# EasyEDA schematic SCH_chris-dual-hd-connector-v3_2021-12-07.json
TITLE: Portenta 4 HD Student Shield; REV: 1.6; Date: 2021-09-13; Sheet: 1/1; Drawn By: rocksetta; Company: Rocksetta
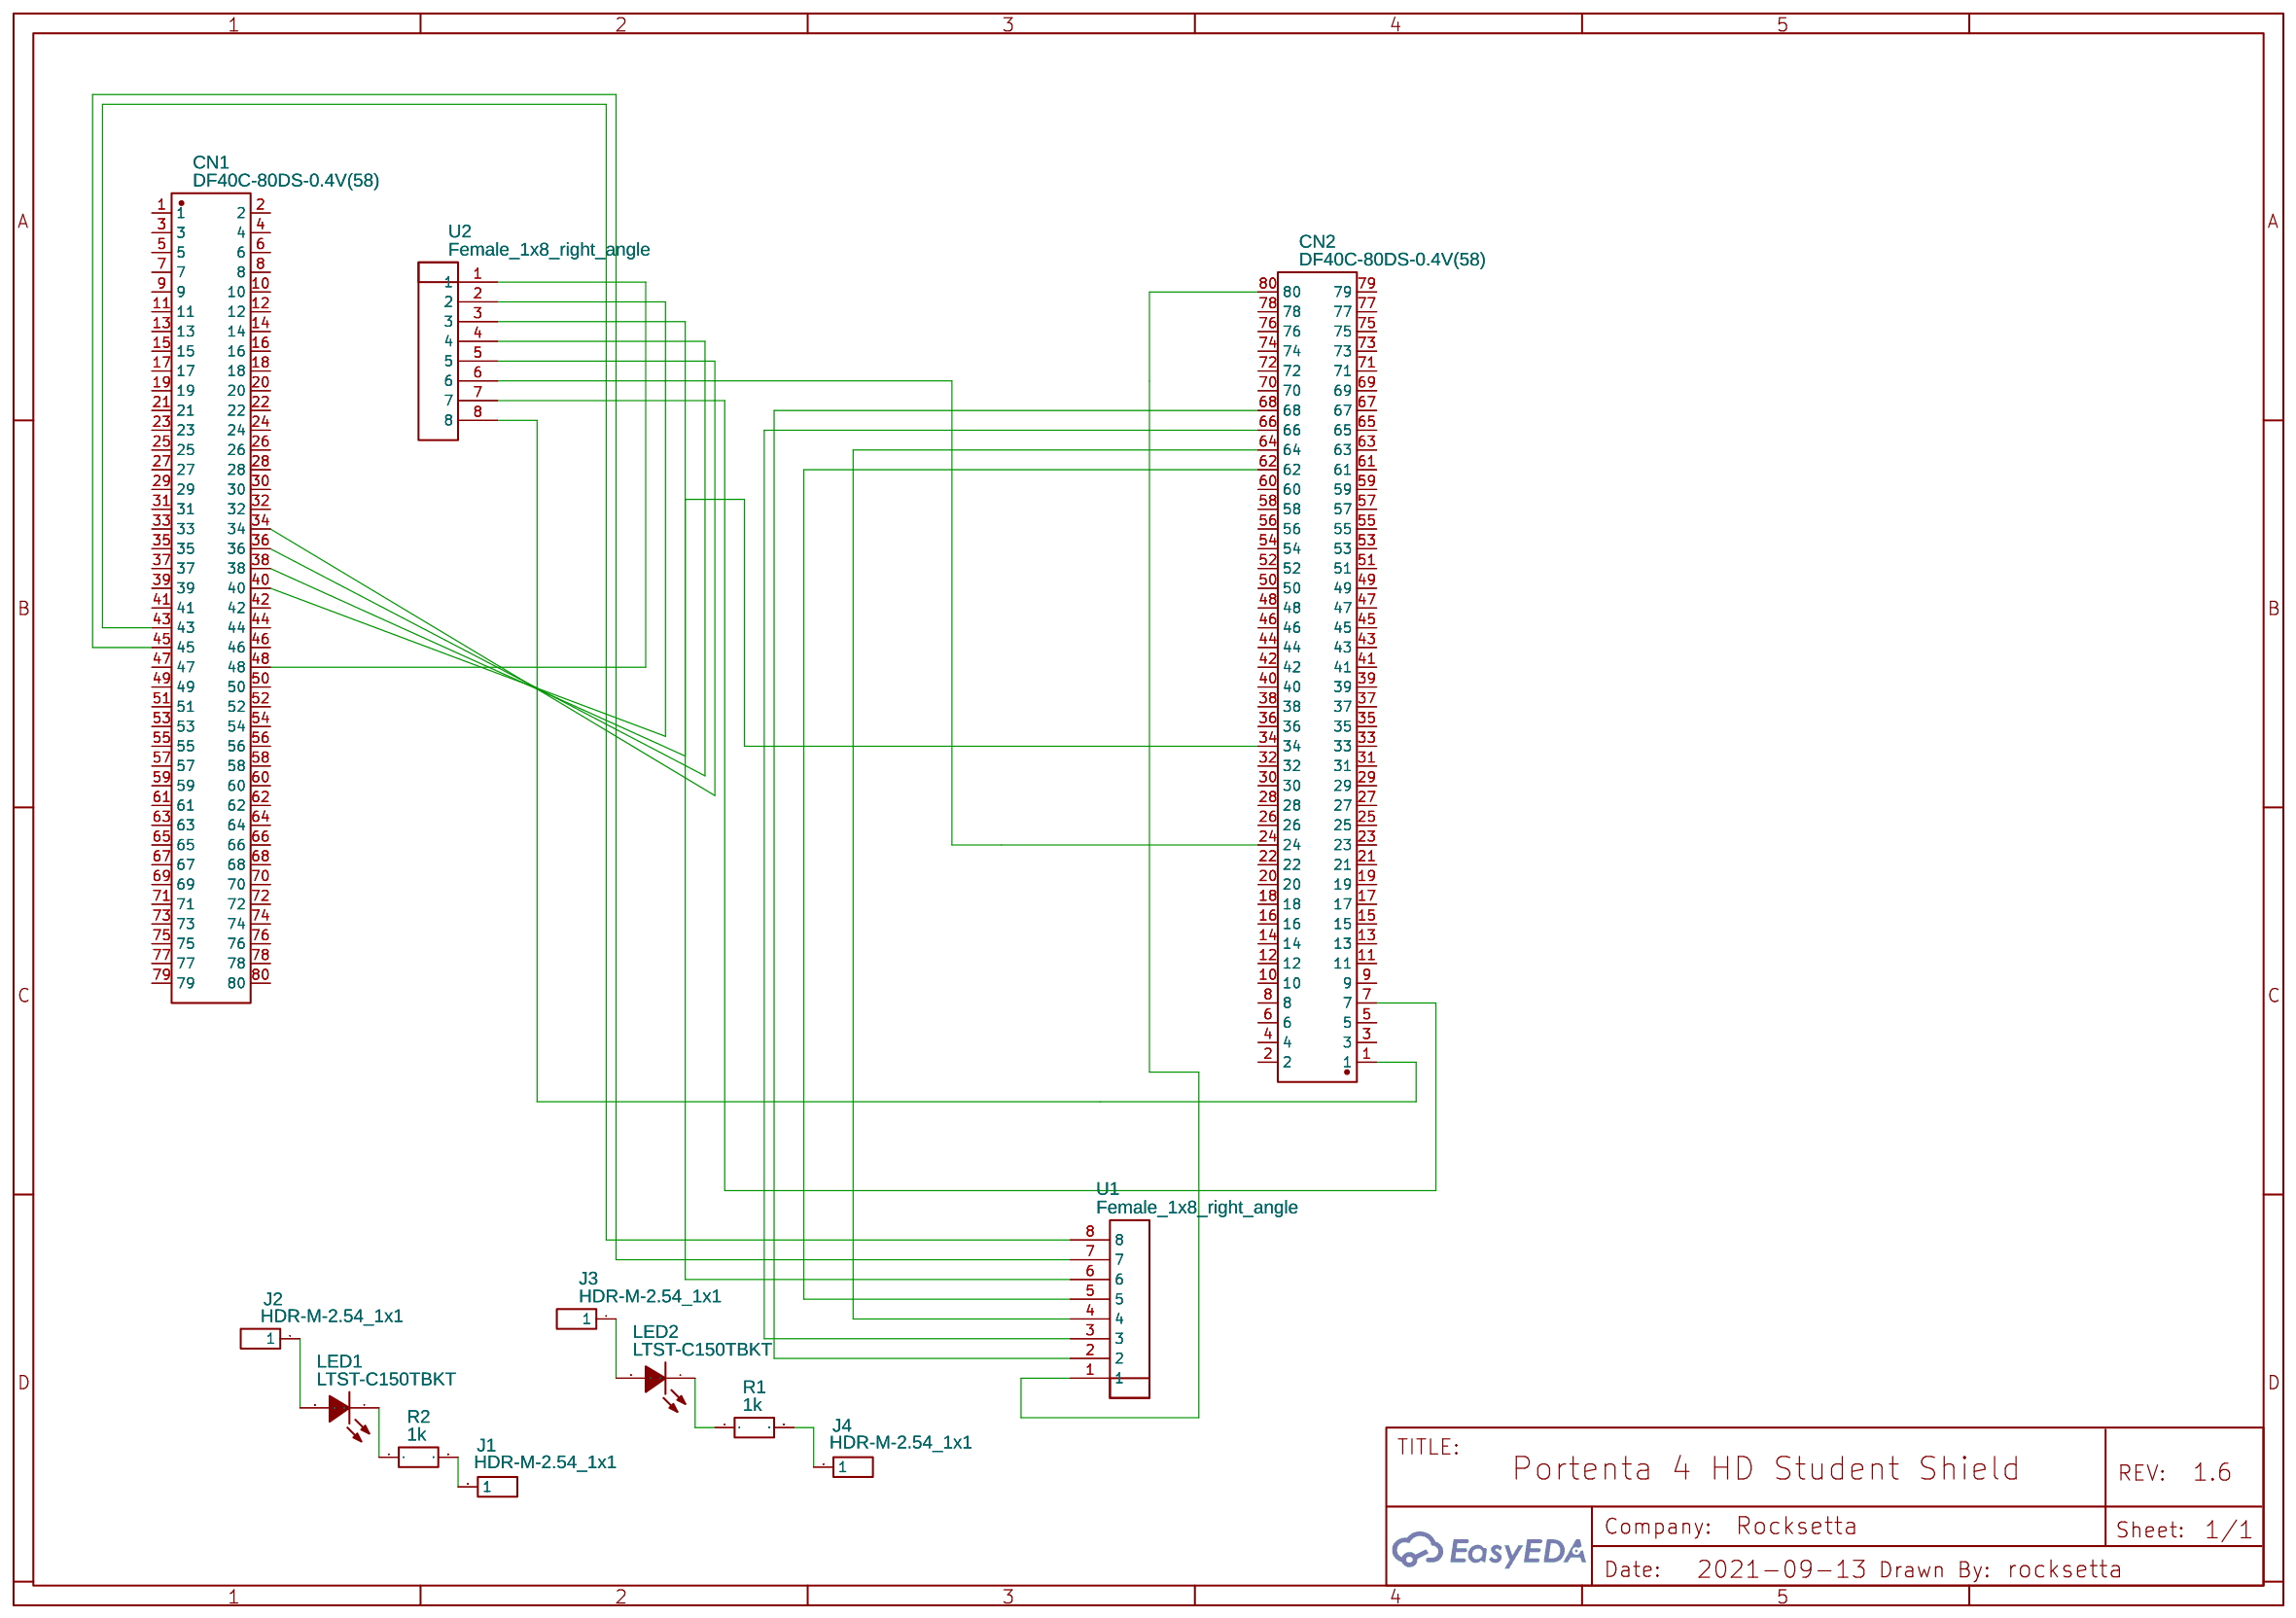
[diagram p0: schematic sheet]

## Parts
CN1  DF40C-80DS-0.4V(58)  [CONN-SMD_DF40C-80DS-0.4V-58]
CN2  DF40C-80DS-0.4V(58)  [CONN-SMD_DF40C-80DS-0.4V-58]
J1  HDR-M-2.54_1x1  [HDR-M-2.54_1X1]
J2  HDR-M-2.54_1x1  [HDR-M-2.54_1X1]
J3  HDR-M-2.54_1x1  [HDR-M-2.54_1X1]
J4  HDR-M-2.54_1x1  [HDR-M-2.54_1X1]
LED1  LTST-C150TBKT  [LED1206-RD_BLUE]
LED2  LTST-C150TBKT  [LED1206-RD_BLUE]
R1  1k  [R0805]
R2  1k  [R0805]
U1  Female_1x8_right_angle  [FEMALE_1X8_RIGHT_ANGLE]
U2  Female_1x8_right_angle  [FEMALE_1X8_RIGHT_ANGLE]

## Library data of the parts
CN1 CN2 = DF40C-80DS-0.4V(58): Supplier: LCSC; Supplier Part: C597941; Manufacturer: HRS(Hirose); Contributor: JLCPCB_Official; link: http://www.farnell.com/datasheets/2691051.pdf
J1-J4 = HDR-M-2.54_1x1: Supplier Part: C81276; Supplier: LCSC; Contributor: LCEDA_Lib
LED1 LED2 = LTST-C150TBKT: Supplier: LCSC; Manufacturer: LITEON; Contributor: LCSC; Supplier Part: C125088; JLCPCB Part Class: Extended Part
R1 R2 = R_0805_EU: Contributor: LCEDA_Lib
U1 U2 = Female_1x8_right_angle: Manufacturer Part: PPPC081LGBN-RC; Supplier: Digi-Key; Supplier Part: S5483-ND; Contributor: Ginodel

## Nets
Net-(CN1-34): CN1.34 U2.5
Net-(CN1-36): CN1.36 U2.4
Net-(CN1-38): CN1.38 U2.3
Net-(CN1-40): CN1.40 U2.2
Net-(CN1-43): CN1.43 U1.8
Net-(CN1-45): CN1.45 U1.7
Net-(CN1-48): CN1.48 U2.1
Net-(CN2-1): CN2.1 U2.8
Net-(CN2-7): CN2.7 U2.7
Net-(CN2-24): CN2.24 U2.6
Net-(CN2-34): CN2.34 U1.6
Net-(CN2-62): CN2.62 U1.5
Net-(CN2-64): CN2.64 U1.4
Net-(CN2-66): CN2.66 U1.3
Net-(CN2-68): CN2.68 U1.2
Net-(CN2-80): CN2.80 U1.1
Net-(J1-1): J1.1 R2.2
Net-(J2-1): J2.1 LED1.2(A)
Net-(J3-1): J3.1 LED2.2(A)
Net-(J4-1): J4.1 R1.2
Net-(LED1-1): LED1.1(K) R2.1
Net-(LED2-1): LED2.1(K) R1.1

Not connected (* = marked no-connect by the designer): CN1 1 2 3 4 5 6 7 8 9 10 11 12 13 14 15 16 17 18 19 20 21 22 23 24 25 26 27 28 29 30 31 32 33 35 37 39 41 42 44 46 47 49 50 51 52 53 54 55 56 57 58 59 60 61 62 63 64 65 66 67 68 69 70 71 72 73 74 75 76 77 78 79 80; CN2 2 3 4 5 6 8 9 10 11 12 13 14 15 16 17 18 19 20 21 22 23 25 26 27 28 29 30 31 32 33 35 36 37 38 39 40 41 42 43 44 45 46 47 48 49 50 51 52 53 54 55 56 57 58 59 60 61 63 65 67 69 70 71 72 73 74 75 76 77 78 79
